# Altium schematic sheet Connector_Sheet.SchDoc
size 420 x 297 mm; SheetNumber: 3; SheetTotal: 3
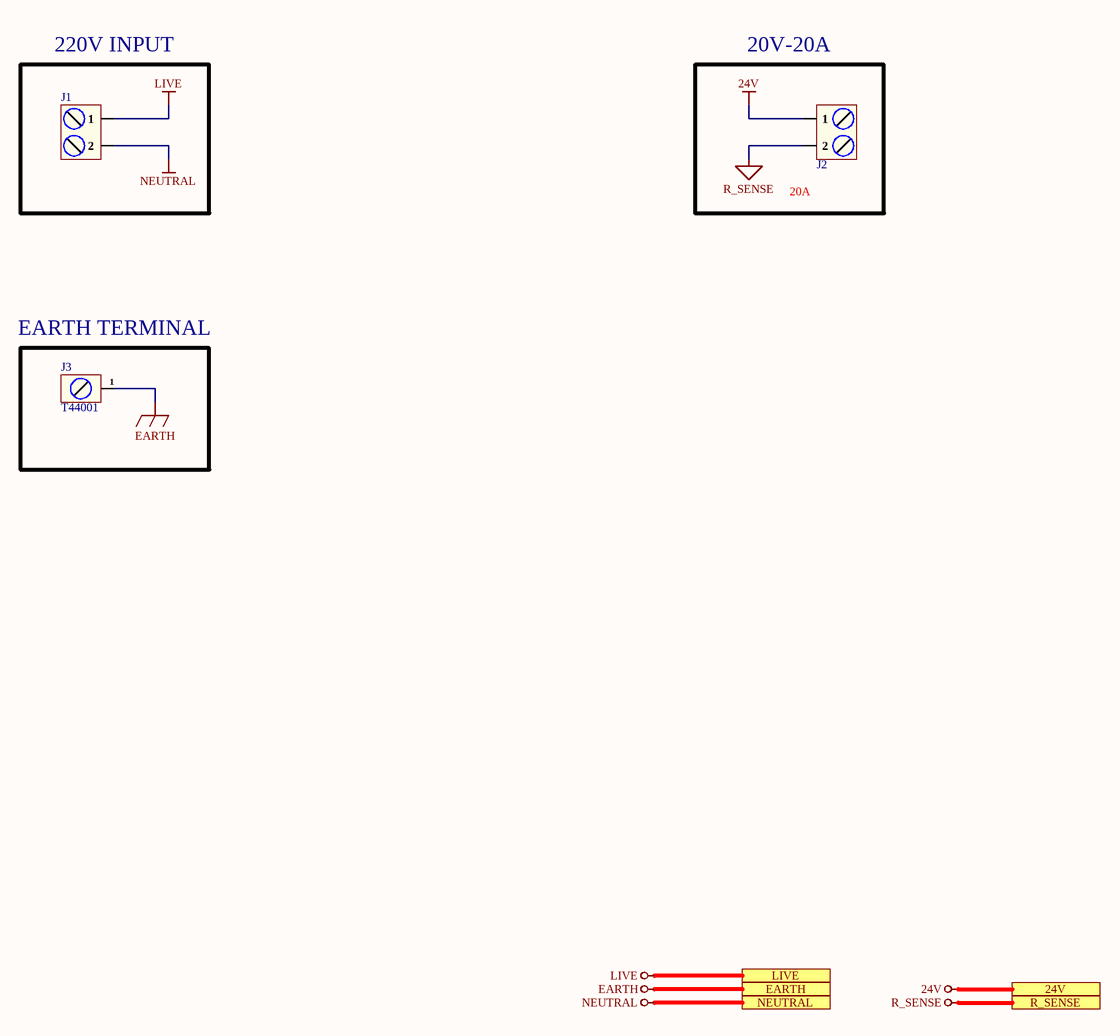
[diagram p0: Connector_Sheet.SchDoc]

## Parts
J1  DBT50G-7.62-2P-BK-P  (value not drawn)
J2  DBT50G-7.62-2P-BK-P  (value not drawn)
J3  T44001  [T44001]

## Blocks framed on the sheet
20A: J2

## Ports
24V (see 24V_Sheet[5D]), EARTH (see Power_Sheet[1A], Power_Sheet[5D]), LIVE (see Power_Sheet[1A], Power_Sheet[5D]), NEUTRAL (see Power_Sheet[1A], Power_Sheet[5D]), R_SENSE (see 24V_Sheet[5D])

## Nets
24V: J2.1 ; port 24V
EARTH: J3.1 ; port EARTH
LIVE: J1.1 ; port LIVE
NEUTRAL: J1.2 ; port NEUTRAL
R_SENSE: J2.2 ; port R_SENSE

## Notes on the sheet
- 220V INPUT
- 20V-20A
- (near J3) EARTH TERMINAL
- File:
- Title:
- Date:
- Page
- Num:
- Total:
- Drawn By: Huzaifa Ali

## Library data of the parts
J1 J2 = DBT50G-7.62-2P-BK-P: 1x2P Corner With Cover Plate 2 1 7.62mm -40℃~+105℃ 20A 300V Black 12~22 Straight Needle Plugin,P=7.62mm Barrier Terminal Blocks ROHS; Manufacturer: DORABO; Manufacturer Part Number: DBT50G-7.62-2P-BK-P; Package: Plugin,P=7.62mm; LCSC Part Number: C496127; Item Type: Terminal Block; ComponentLink1Description: LCSC; ComponentLink1URL: https://www.lcsc.com/product-detail/Barrier-Terminal-Blocks_DORABO-DBT50G-7-62-2P-BK-P_C496127.html
J3 = T44001: M4 Plugin PCB Welding Terminal ROHS; Manufacturer: XFCN; Manufacturer Part Number: T44001; Package: Plugin; ComponentLink1Description: LCSC; ComponentLink1URL: *